# Altium schematic sheet Sheet4_CAN_Interface.SchDoc
size B; CompanyName: Microchip Technology Inc.; Organization: Microchip Technology; Address1: 2355 West Chandler Blvd.; Address2: Chandler, AZ  85224; Address4: USA; DocumentNumber: 4; SheetNumber: 4; SheetTotal: 5; SheetTitle: CAN Interface; Time: Time
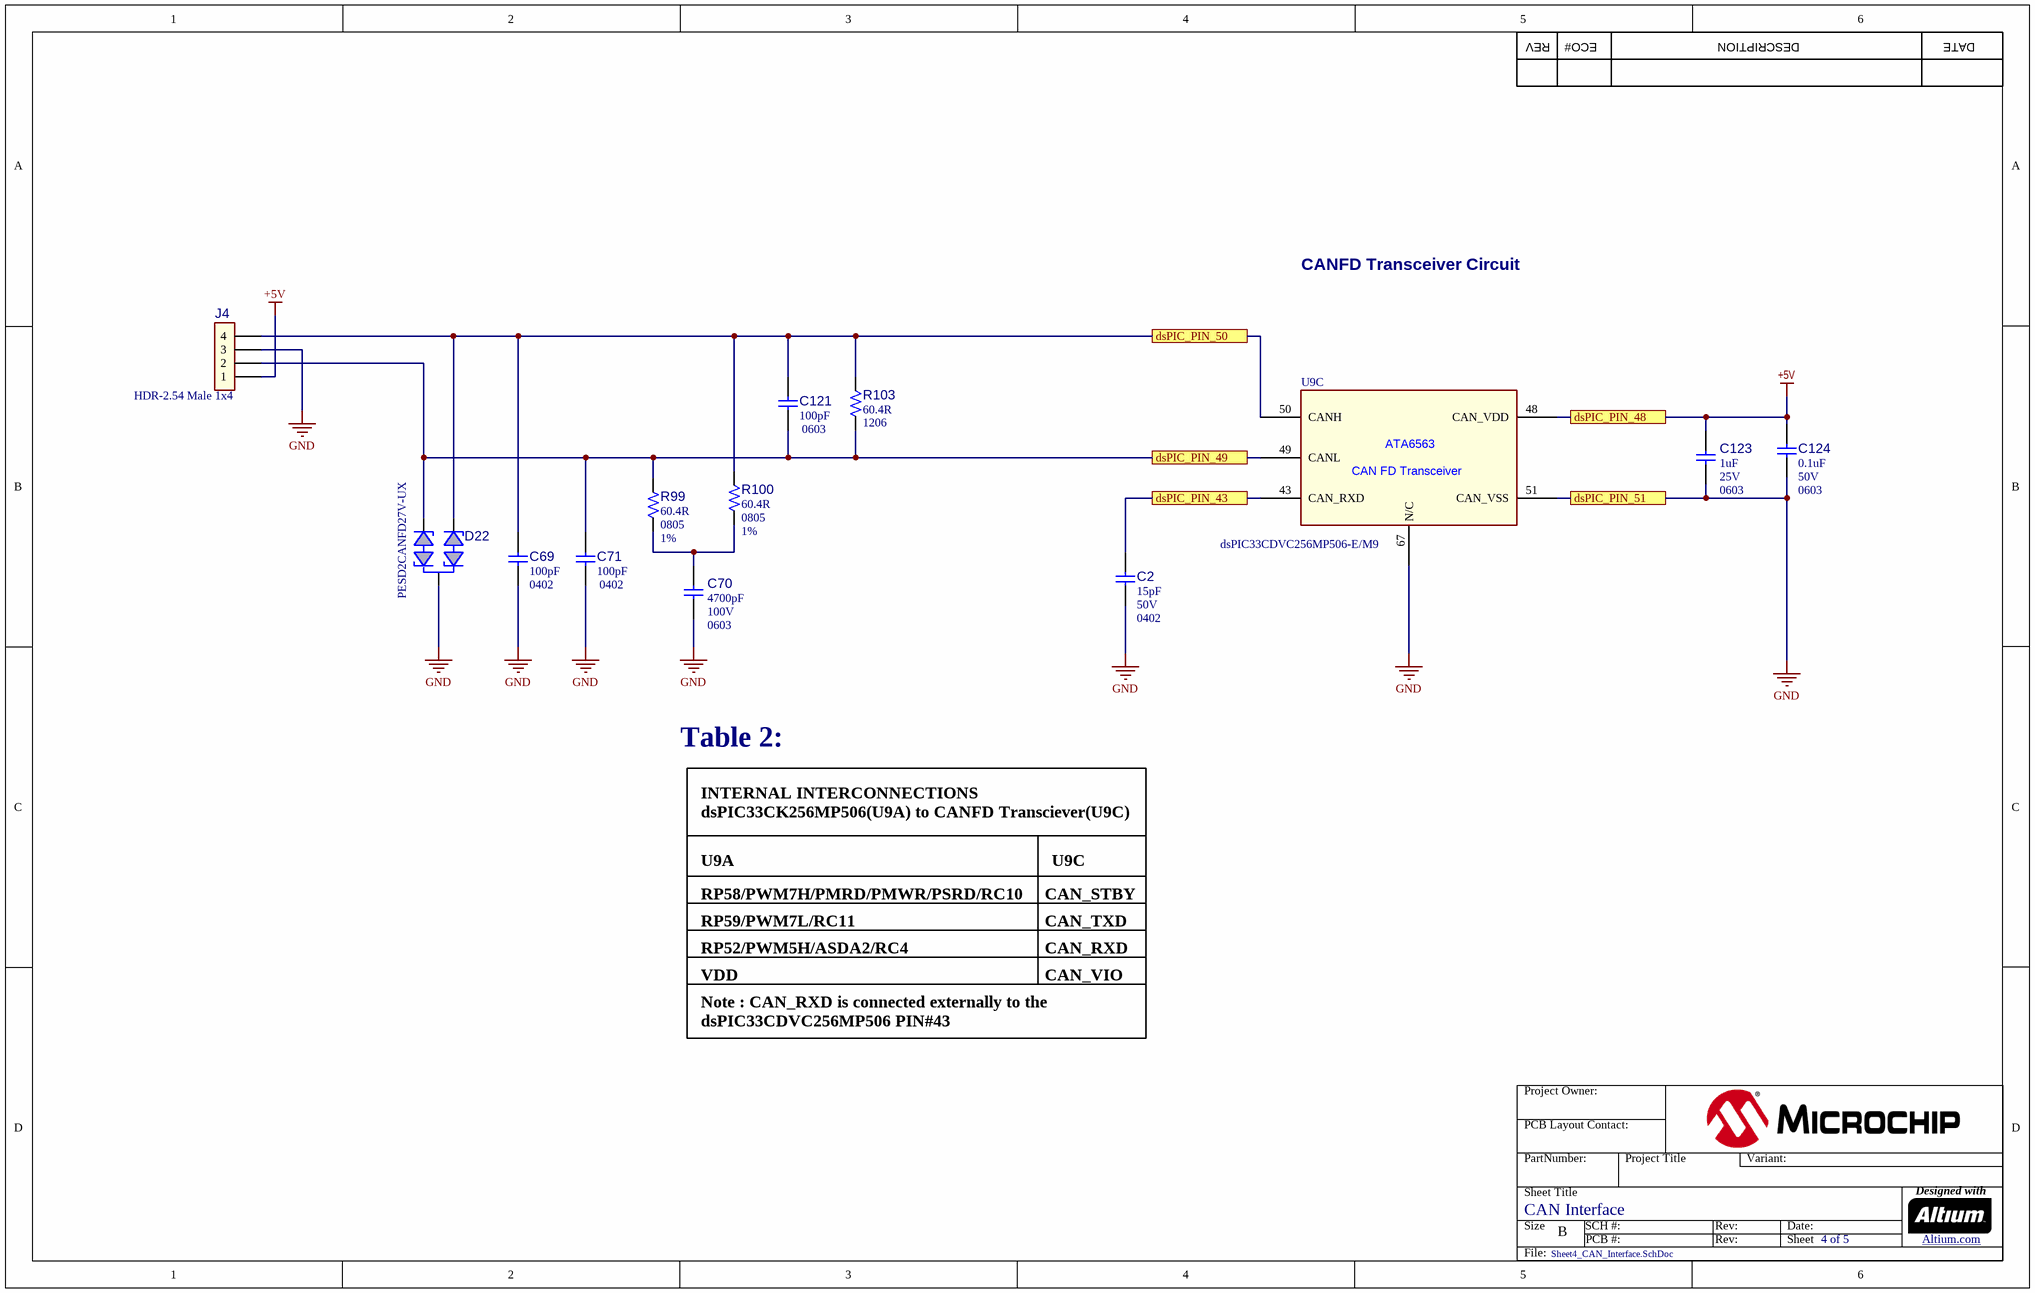
[diagram p0: Sheet4_CAN_Interface.SchDoc]

## Parts
C2  value 15pF  Voltage: 50V  Package: 0402  [CAP_C_0402]  (hidden comment: Capacitor NP)
C69  value 100pF  Package: 0402  [CAP_C_0402]  (hidden comment: Capacitor NP)
C70  value 4700pF  Voltage: 100V  Package: 0603  [CAP_C_0603]  (hidden comment: Capacitor NP)
C71  value 100pF  Package: 0402  [CAP_C_0402]  (hidden comment: Capacitor NP)
C121  value 100pF  Package: 0603  [CAP_C_0603]  (hidden comment: Capacitor NP)
C123  value 1uF  Voltage: 25V  Package: 0603  [CAP_C_0603]  (hidden comment: Capacitor NP)
C124  value 0.1uF  Voltage: 50V  Package: 0603  [CAP_C_0603]  (hidden comment: Capacitor NP)
D22  Manufacturer Part Number 1: PESD2CANFD27V-UX  [SOT-323-3]  (hidden comment: Diode K1K2CC ESD Bidirectional)
J4  value HDR-2.54 Male 1x4  [HDR_M_2.54_1x4]  (hidden comment: Header 1x4)
R99  value 60.4R  Package: 0805  Tolerance: 1%  [RES_C_0805]  (hidden comment: Resistor)
R100  value 60.4R  Package: 0805  Tolerance: 1%  [RES_C_0805]  (hidden comment: Resistor)
R103  value 60.4R  Package: 1206  [RES_C_1206]  (hidden comment: Resistor)
U9  value dsPIC33CDVC256MP506-E/M9  [QFN-64_9X9_3EP_M9]  (hidden comment: dsPIC33CDVC256MP506_VGQFN-64)  (part C of 3)

## Ports
dsPIC_PIN_43, dsPIC_PIN_48, dsPIC_PIN_49, dsPIC_PIN_50, dsPIC_PIN_51

## Nets
+5V: C123.1 C124.2 J4.1 U9.48(CAN_VDD) ; port dsPIC_PIN_48
GND: C2.1 C69.2 C70.1 C71.2 C123.2 C124.1 D22.3(CC) J4.3 U9.51(CAN_VSS) U9.67(N/C) ; port dsPIC_PIN_51
dsPIC_PIN_43: C2.2 U9.43(CAN_RXD) ; port dsPIC_PIN_43
dsPIC_PIN_49: C71.1 C121.1 D22.1(K1) J4.2 R99.2 R103.1 U9.49(CANL) ; port dsPIC_PIN_49
dsPIC_PIN_50: C69.1 C121.2 D22.2(K2) J4.4 R100.2 R103.2 U9.50(CANH) ; port dsPIC_PIN_50
NetC70_2: C70.2 R99.1 R100.1

## Notes on the sheet
- REV
- ECO#
- DESCRIPTION
- DATE
- CANFD Transceiver Circuit
- Table 2:
- INTERNAL INTERCONNECTIONS dsPIC33CK256MP506(U9A) to CANFD Transciever(U9C)
- U9A
- RP58/PWM7H/PMRD/PMWR/PSRD/RC10
- CAN_STBY
- U9C
- RP59/PWM7L/RC11
- RP52/PWM5H/ASDA2/RC4
- CAN_TXD
- CAN_RXD
- Note : CAN_RXD is connected externally to the dsPIC33CDVC256MP506 PIN#43
- VDD
- CAN_VIO
- Project Owner:
- PCB Layout Contact:
- PartNumber:
- Project Title
- Variant:
- Sheet Title
- Size
- B
- SCH #:
- PCB #:
- Rev:
- Date:
- Sheet
- Designed with
- Altium.com <http://go.altium.com/MicrochipLandingPage_Evaluation.html>
- File:
- (in symbol MIC9437, part C) ATA6563; CAN FD Transceiver

## Library data of the parts
C2 = CAP0608: Manufacturer 1: Murata; Manufacturer Part Number 1: GRM1555C1H150JA01D; Description_: CAP CER 15pF 50V 5% NP0 SMD 0402; Dev Tools Status: Production; Tolerance: 5%; Temperature Coefficient: NP0; Type: Ceramic; Populated: Yes; Restricted Sourcing: No; MCHP-ID: CAP0608; Revision: 4; Symbol: Capacitor NP; Status: MCL Design; ComponentLink1URL: https://chn-vm-apps.microchip.com/mchprepo/parts/Datasheets/L0005E.pdf; ComponentLink1Description: SVN Datasheet; ComponentLink2URL: C:\ALTIUM_WORK\00001_MCHP-CDB\Datasheets\L0005E.pdf; ComponentLink2Description: Local Datasheet; ComponentLink3URL: C:\ALTIUM_WORK\00001_MCHP-CDB\Library\LibraryRefs\Capacitor NP.SchLib; ComponentLink3Description: Open Symbol; ComponentLink4URL: C:\ALTIUM_WORK\00001_MCHP-CDB\Library\Footprints\CAP_C_0402.PcbLib; ComponentLink4Description: Open Footprint; ComponentLink5Description: Open Footprint 2; ComponentLink6Description: Open Footprint 3; ComponentLink7Description: Open Footprint 4; Operating Temperature: -55C to +125C; Category: Capacitor; Manufacturer 2: Samsung Electro-Mechanics; Manufacturer Part Number 2: CL05C150JB5NNN; Manufacturer 3: Yageo; Manufacturer Part Number 3: CC0402JRNPO9BN150; Supplier 1: Digi-Key; Supplier Part Number 1: 490-5888-2-ND; Supplier 2: Samsung Electro-Mechanics; Supplier Part Number 2: CL05C150JB5NNN; Supplier 3: Yageo; Supplier Part Number 3: CC0402JRNPO9BN150; Quantity Override: 1
C69 C71 = CAP1039: Manufacturer 1: Samsung Electro-Mechanics; Manufacturer Part Number 1: CL05C101JB5NNNC; Voltage: 50V; Description_: CAP CER 100pF 50V 5% C0G SMD 0402; Dev Tools Status: Production; Tolerance: 5%; Temperature Coefficient: C0G; Type: Ceramic; Owner: Sompoch Loboonlert; Populated: Yes; Restricted Sourcing: No; MCHP-ID: CAP1039; Revision: 5; Symbol: Capacitor NP; Status: MCL Design; ComponentLink1URL: https://chn-vm-apps.microchip.com/mchprepo/parts/Datasheets/L0005E.pdf; ComponentLink1Description: SVN Datasheet; ComponentLink2URL: C:\ALTIUM_WORK\00001_MCHP-CDB\Datasheets\L0005E.pdf; ComponentLink2Description: Local Datasheet; ComponentLink3URL: C:\ALTIUM_WORK\00001_MCHP-CDB\Library\LibraryRefs\Capacitor NP.SchLib; ComponentLink3Description: Open Symbol; ComponentLink4URL: C:\ALTIUM_WORK\00001_MCHP-CDB\Library\Footprints\CAP_C_0402.PcbLib; ComponentLink4Description: Open Footprint; ComponentLink5Description: Open Footprint 2; ComponentLink6Description: Open Footprint 3; ComponentLink7Description: Open Footprint 4; Operating Temperature: -55C to +125C; Category: Capacitor; Supplier 1: Digi-Key; Supplier Part Number 1: 1276-1025-1-ND; Supplier 2: Digi-Key; Supplier Part Number 2: 490-5922-2-ND; Quantity Override: 1; Manufacturer 2: Murata; Manufacturer Part Number 2: GRM1555C1H101JA01D; Manufacturer 3: Yageo; Manufacturer Part Number 3: CC0402JRNPO9BN101; Supplier 3: Yageo; Supplier Part Number 3: CC0402JRNPO9BN101
C70 = CAP2601: Manufacturer 1: TDK Corporation; Manufacturer Part Number 1: CGA3E2X7R2A472K080AA; Description_: CAP CER 4700pF 100V 10% X7R SMD 0603 AEC-Q200; Dev Tools Status: Design; Tolerance: 10%; Temperature Coefficient: X7R; Type: Ceramic; Owner: Narasimha Murthy; Populated: YES; MCHP-ID: CAP2601; Revision: 1; Symbol: Capacitor NP; Status: MCL Design; ComponentLink1URL: https://chn-vm-apps.microchip.com/mchprepo/parts/Datasheets/mlcc_automotive_general_en.pdf; ComponentLink1Description: SVN Datasheet; ComponentLink2URL: C:\ALTIUM_WORK\00001_MCHP-CDB\Datasheets\mlcc_automotive_general_en.pdf; ComponentLink2Description: Local Datasheet; ComponentLink3URL: C:\ALTIUM_WORK\00001_MCHP-CDB\Library\LibraryRefs\Capacitor NP.SchLib; ComponentLink3Description: Open Symbol; ComponentLink4URL: C:\ALTIUM_WORK\00001_MCHP-CDB\Library\Footprints\CAP_C_0603.PcbLib; ComponentLink4Description: Open Footprint; ComponentLink5Description: Open Footprint 2; ComponentLink6Description: Open Footprint 3; ComponentLink7Description: Open Footprint 4; Operating Temperature: -55C to +125C; Category: Capacitor; Supplier 1: Digi-Key; Supplier Part Number 1: 445-5810-1-ND; Quantity Override: 1
C121 = CAP1112: Manufacturer 1: KEMET; Manufacturer Part Number 1: C0603C101J1GACTU; Voltage: 100V; Description_: CAP CER 100pF 100V 5% C0G SMD 0603; Dev Tools Status: Production; Tolerance: 5%; Temperature Coefficient: C0G, NP0; Type: Ceramic; Owner: Mihai T(M91442); Populated: Yes; MCHP-ID: CAP1112; Revision: 0; Symbol: Capacitor NP; Status: MCL Design; ComponentLink1URL: https://chn-vm-apps.microchip.com/mchprepo/parts/Datasheets/KEM_C1003_C0G_SMD.pdf; ComponentLink1Description: SVN Datasheet; ComponentLink2URL: C:\ALTIUM_WORK\00001_MCHP-CDB\Datasheets\KEM_C1003_C0G_SMD.pdf; ComponentLink2Description: Local Datasheet; ComponentLink3URL: C:\ALTIUM_WORK\00001_MCHP-CDB\Library\LibraryRefs\Capacitor NP.SchLib; ComponentLink3Description: Open Symbol; ComponentLink4URL: C:\ALTIUM_WORK\00001_MCHP-CDB\Library\Footprints\CAP_C_0603.PcbLib; ComponentLink4Description: Open Footprint; ComponentLink5Description: Open Footprint 2; ComponentLink6Description: Open Footprint 3; ComponentLink7Description: Open Footprint 4; Operating Temperature: -55C to +125C; Category: Capacitor; Supplier 1: Digi-Key; Supplier Part Number 1: 399-7821-1-ND; Supplier 2: Farnell; Supplier Part Number 2: 1414602; Quantity Override: 1
C123 = CAP1060: Manufacturer 1: Yageo; Manufacturer Part Number 1: CC0603KRX7R8BB105; Description_: CAP CER 1uF 25V 10% X7R SMD 0603; Dev Tools Status: Production; Tolerance: 10%; Temperature Coefficient: X7R; Type: Ceramic; Owner: Sompoch Loboonlert; Populated: YES; Restricted Sourcing: No; MCHP-ID: CAP1060; Revision: 1; Symbol: Capacitor NP; Status: MCL Design; ComponentLink1Description: SVN Datasheet; ComponentLink2Description: Local Datasheet; ComponentLink3URL: C:\ALTIUM_WORK\00001_MCHP-CDB\Library\LibraryRefs\Capacitor NP.SchLib; ComponentLink3Description: Open Symbol; ComponentLink4URL: C:\ALTIUM_WORK\00001_MCHP-CDB\Library\Footprints\CAP_C_0603.PcbLib; ComponentLink4Description: Open Footprint; ComponentLink5Description: Open Footprint 2; ComponentLink6Description: Open Footprint 3; ComponentLink7Description: Open Footprint 4; Operating Temperature: -55C to +125C; Category: Capacitor; Supplier 1: Digi-Key; Supplier Part Number 1: 311-1802-1-ND; Quantity Override: 1; Manufacturer 2: Samsung Electro-Mechanics; Manufacturer Part Number 2: CL10B105KA8NNNC; Supplier 2: Samsung Electro-Mechanics; Supplier Part Number 2: CL10B105KA8NNNC
C124 = CAP2033: Manufacturer 1: Yageo; Manufacturer Part Number 1: CC0603KRX7R9BB104; Description_: CAP CER 0.1uF 50V 10% X7R SMD 0603; Dev Tools Status: Production; Tolerance: ±10%; Temperature Coefficient: X7R; Type: Ceramic; Owner: Jose Garcia; Populated: YES; MCHP-ID: CAP2033; Revision: 1; Symbol: Capacitor NP; Status: MCL Design; ComponentLink1Description: SVN Datasheet; ComponentLink2Description: Local Datasheet; ComponentLink3URL: C:\ALTIUM_WORK\00001_MCHP-CDB\Library\LibraryRefs\Capacitor NP.SchLib; ComponentLink3Description: Open Symbol; ComponentLink4URL: C:\ALTIUM_WORK\00001_MCHP-CDB\Library\Footprints\CAP_C_0603.PcbLib; ComponentLink4Description: Open Footprint; ComponentLink5Description: Open Footprint 2; ComponentLink6Description: Open Footprint 3; ComponentLink7Description: Open Footprint 4; Operating Temperature: -55°C ~ 125°C; Category: Capacitor; Supplier 1: Digi-Key; Supplier Part Number 1: 311-1344-1-ND; Quantity Override: 1
D22 = DIODE1814: Manufacturer 1: Nexperia USA Inc.; Value: PESD2CANFD27V-UX; Description_: DIO TVS ARRAY PESD2CANFD27V-UX 27V 1A SOT-323-3; Dev Tools Status: Design; Type: TVS Array; Reverse Voltage: 27V; Owner: Narasimha Murthy; Populated: Yes; MCHP-ID: DIODE1814; Revision: 1; Symbol: Diode K1K2CC ESD Bidirectional; Status: MCL Design; Package: SOT323; ComponentLink1URL: https://chn-vm-apps.microchip.com/mchprepo/parts/Datasheets/PESD2CANFD27V-U.pdf; ComponentLink1Description: SVN Datasheet; ComponentLink2URL: C:\ALTIUM_WORK\00001_MCHP-CDB\Datasheets\PESD2CANFD27V-U.pdf; ComponentLink2Description: Local Datasheet; ComponentLink3URL: C:\ALTIUM_WORK\00001_MCHP-CDB\Library\LibraryRefs\Diode K1K2CC ESD Bidirectional.SchLib; ComponentLink3Description: Open Symbol; ComponentLink4URL: C:\ALTIUM_WORK\00001_MCHP-CDB\Library\Footprints\SOT-323-3.PcbLib; ComponentLink4Description: Open Footprint; ComponentLink5Description: Open Footprint 2; ComponentLink6Description: Open Footprint 3; ComponentLink7Description: Open Footprint 4; Category: Diode; Supplier 1: Digi-Key; Supplier Part Number 1: 1727-PESD2CANFD27V-UXCT-ND; Quantity Override: 1
J4 = CON0148: Manufacturer 1: Samtec; Manufacturer Part Number 1: TSW-104-07-G-S; Description_: CON HDR-2.54 Male 1x4 Gold 5.84MH TH VERT; Dev Tools Status: Production; Populated: Yes; Restricted Sourcing: No; MCHP-ID: CON0148; Revision: 4; Symbol: Header 1x4; Status: MCL Design; ComponentLink1URL: https://chn-vm-apps.microchip.com/mchprepo/parts/Datasheets/TSW-XXX-XX-XXX-X-XX-XXX-MKT.pdf; ComponentLink1Description: SVN Datasheet; ComponentLink2URL: C:\ALTIUM_WORK\00001_MCHP-CDB\Datasheets\TSW-XXX-XX-XXX-X-XX-XXX-MKT.pdf; ComponentLink2Description: Local Datasheet; ComponentLink3URL: C:\ALTIUM_WORK\00001_MCHP-CDB\Library\LibraryRefs\Header 1x4.SchLib; ComponentLink3Description: Open Symbol; ComponentLink4URL: C:\ALTIUM_WORK\00001_MCHP-CDB\Library\Footprints\HDR_M_2.54_1x4.PcbLib; ComponentLink4Description: Open Footprint; ComponentLink5Description: Open Footprint 2; ComponentLink6Description: Open Footprint 3; ComponentLink7Description: Open Footprint 4; Type: Header 2.54mm; Category: Connector; Supplier 1: Digi-Key; Supplier Part Number 1: SAM1029-04-ND; Quantity Override: 1; Manufacturer 2: Würth Elektronik; Manufacturer Part Number 2: 61300411121; Manufacturer 3: SHENZHEN JUNHAO ENGINEERING; Manufacturer Part Number 3: 211-0411-0021-401; Supplier 2: Digi-Key; Supplier Part Number 2: 732-5317-ND; Supplier 3: SHENZHEN JUNHAO ENGINEERING; Supplier Part Number 3: 211-0411-0021-401
R99 R100 = RES3404: Manufacturer 1: Vishay; Manufacturer Part Number 1: RCS080560R4FKEA; Description_: RES TKF 60.4R 1% 1/2W SMD 0805 AEC-Q200; Dev Tools Status: Design; Temperature Coefficient: 100ppm/C; Power: 1/2W; Owner: Severino Balong Jr.; Populated: YES; Restricted Sourcing: No; MCHP-ID: RES3404; Revision: 2; Symbol: Resistor; Status: MCL Design; ComponentLink1Description: SVN Datasheet; ComponentLink2Description: Local Datasheet; ComponentLink3URL: C:\ALTIUM_WORK\00001_MCHP-CDB\Library\LibraryRefs\Resistor.SchLib; ComponentLink3Description: Open Symbol; ComponentLink4URL: C:\ALTIUM_WORK\00001_MCHP-CDB\Library\Footprints\RES_C_0805.PcbLib; ComponentLink4Description: Open Footprint; ComponentLink5Description: Open Footprint 2; ComponentLink6Description: Open Footprint 3; ComponentLink7Description: Open Footprint 4; Operating Temperature: -55C to +155C; Category: Resistor; Type: RES SMD; Composition: TKF; Supplier 1: Digi-Key; Supplier Part Number 1: 541-RCS080560R4FKEATR-ND; Quantity Override: 1
R103 = RSMT1360: Manufacturer 1: TE Connectivity Passive Product; Manufacturer Part Number 1: RQ73C2B60R4BTD; Tolerance: 0.1%; Description_: RES TF 60.4R 0.1% 0.4W SMD 1206 AEC-Q200; Dev Tools Status: Design; Voltage: 200V; Temperature Coefficient: 10ppm/C; Power: 0.4W; Owner: Narasimha Murthy; Populated: Yes; MCHP-ID: RSMT1360; Revision: 1; Symbol: Resistor; Status: MCL Design; ComponentLink1URL: https://chn-vm-apps.microchip.com/mchprepo/parts/Datasheets/PYu-RC_Group_51_RoHS_L_11.pdf; ComponentLink1Description: SVN Datasheet; ComponentLink2URL: C:\ALTIUM_WORK\00001_MCHP-CDB\Datasheets\PYu-RC_Group_51_RoHS_L_11.pdf; ComponentLink2Description: Local Datasheet; ComponentLink3URL: C:\ALTIUM_WORK\00001_MCHP-CDB\Library\LibraryRefs\Resistor.SchLib; ComponentLink3Description: Open Symbol; ComponentLink4URL: C:\ALTIUM_WORK\00001_MCHP-CDB\Library\Footprints\RES_C_1206.PcbLib; ComponentLink4Description: Open Footprint; ComponentLink5Description: Open Footprint 2; ComponentLink6Description: Open Footprint 3; ComponentLink7Description: Open Footprint 4; Operating Temperature: -55C to +155C; Category: Resistor; Type: RES SMD; Composition: TF; Supplier 1: Digi-Key; Supplier Part Number 1: A140655CT-ND; Quantity Override: 1
U9 = MIC9437: Manufacturer 1: Microchip Technology; Description_: MCHP MCU 16-BIT 100MIPS 256kB 24kB dsPIC33CDVC256MP506-E/M9; Dev Tools Status: Design; Owner: Narasimha Murthy; Populated: YES; MCHP-ID: MIC9437; Symbol: dsPIC33CDVC256MP506_VGQFN-64; Type: 16-Bit; Status: MCL Design; Revision: 1; Category: MCHP-Microcontroller; ComponentLink1URL: https://www.microchip.com/sitesearch/search/Product%20and%20Development%20Tools/dsPIC33CDVC256MP506-E/M9; ComponentLink1Description: SVN Datasheet; ComponentLink2Description: Local Datasheet; ComponentLink3URL: C:\ALTIUM_WORK\00001_MCHP-CDB\Library\LibraryRefs\dsPIC33CDVC256MP506_VGQFN-64.SchLib; ComponentLink3Description: Open Symbol; ComponentLink4URL: C:\ALTIUM_WORK\00001_MCHP-CDB\Library\Footprints\QFN-64_9X9_3EP_M9.PcbLib; ComponentLink4Description: Open Footprint; ComponentLink5Description: Open Footprint 2; ComponentLink6Description: Open Footprint 3; ComponentLink7Description: Open Footprint 4; Manufacturer Part Number 1: dsPIC33CDVC256MP506-E/M9; Supplier 1: Microchip Technology; Supplier Part Number 1: dsPIC33CDVC256MP506-E/M9; Operating Temperature: -40C to +125C; Quantity Override: 1